# EasyEDA Pro project obd_schematic_27th_Jan_2026.eprj

# Schematic obd_schematic

## Sheets
1 gps_gsm: Board Name: Board1; Create Date: 2026-01-10; Page Name: gps_gsm; Project Name: obd_schematic_27th_Jan_2026; Schematic Name: obd_schematic; Update Date: 2026-01-30; Company: EasyEDA.com; Page Size: A4; Version: V1.0
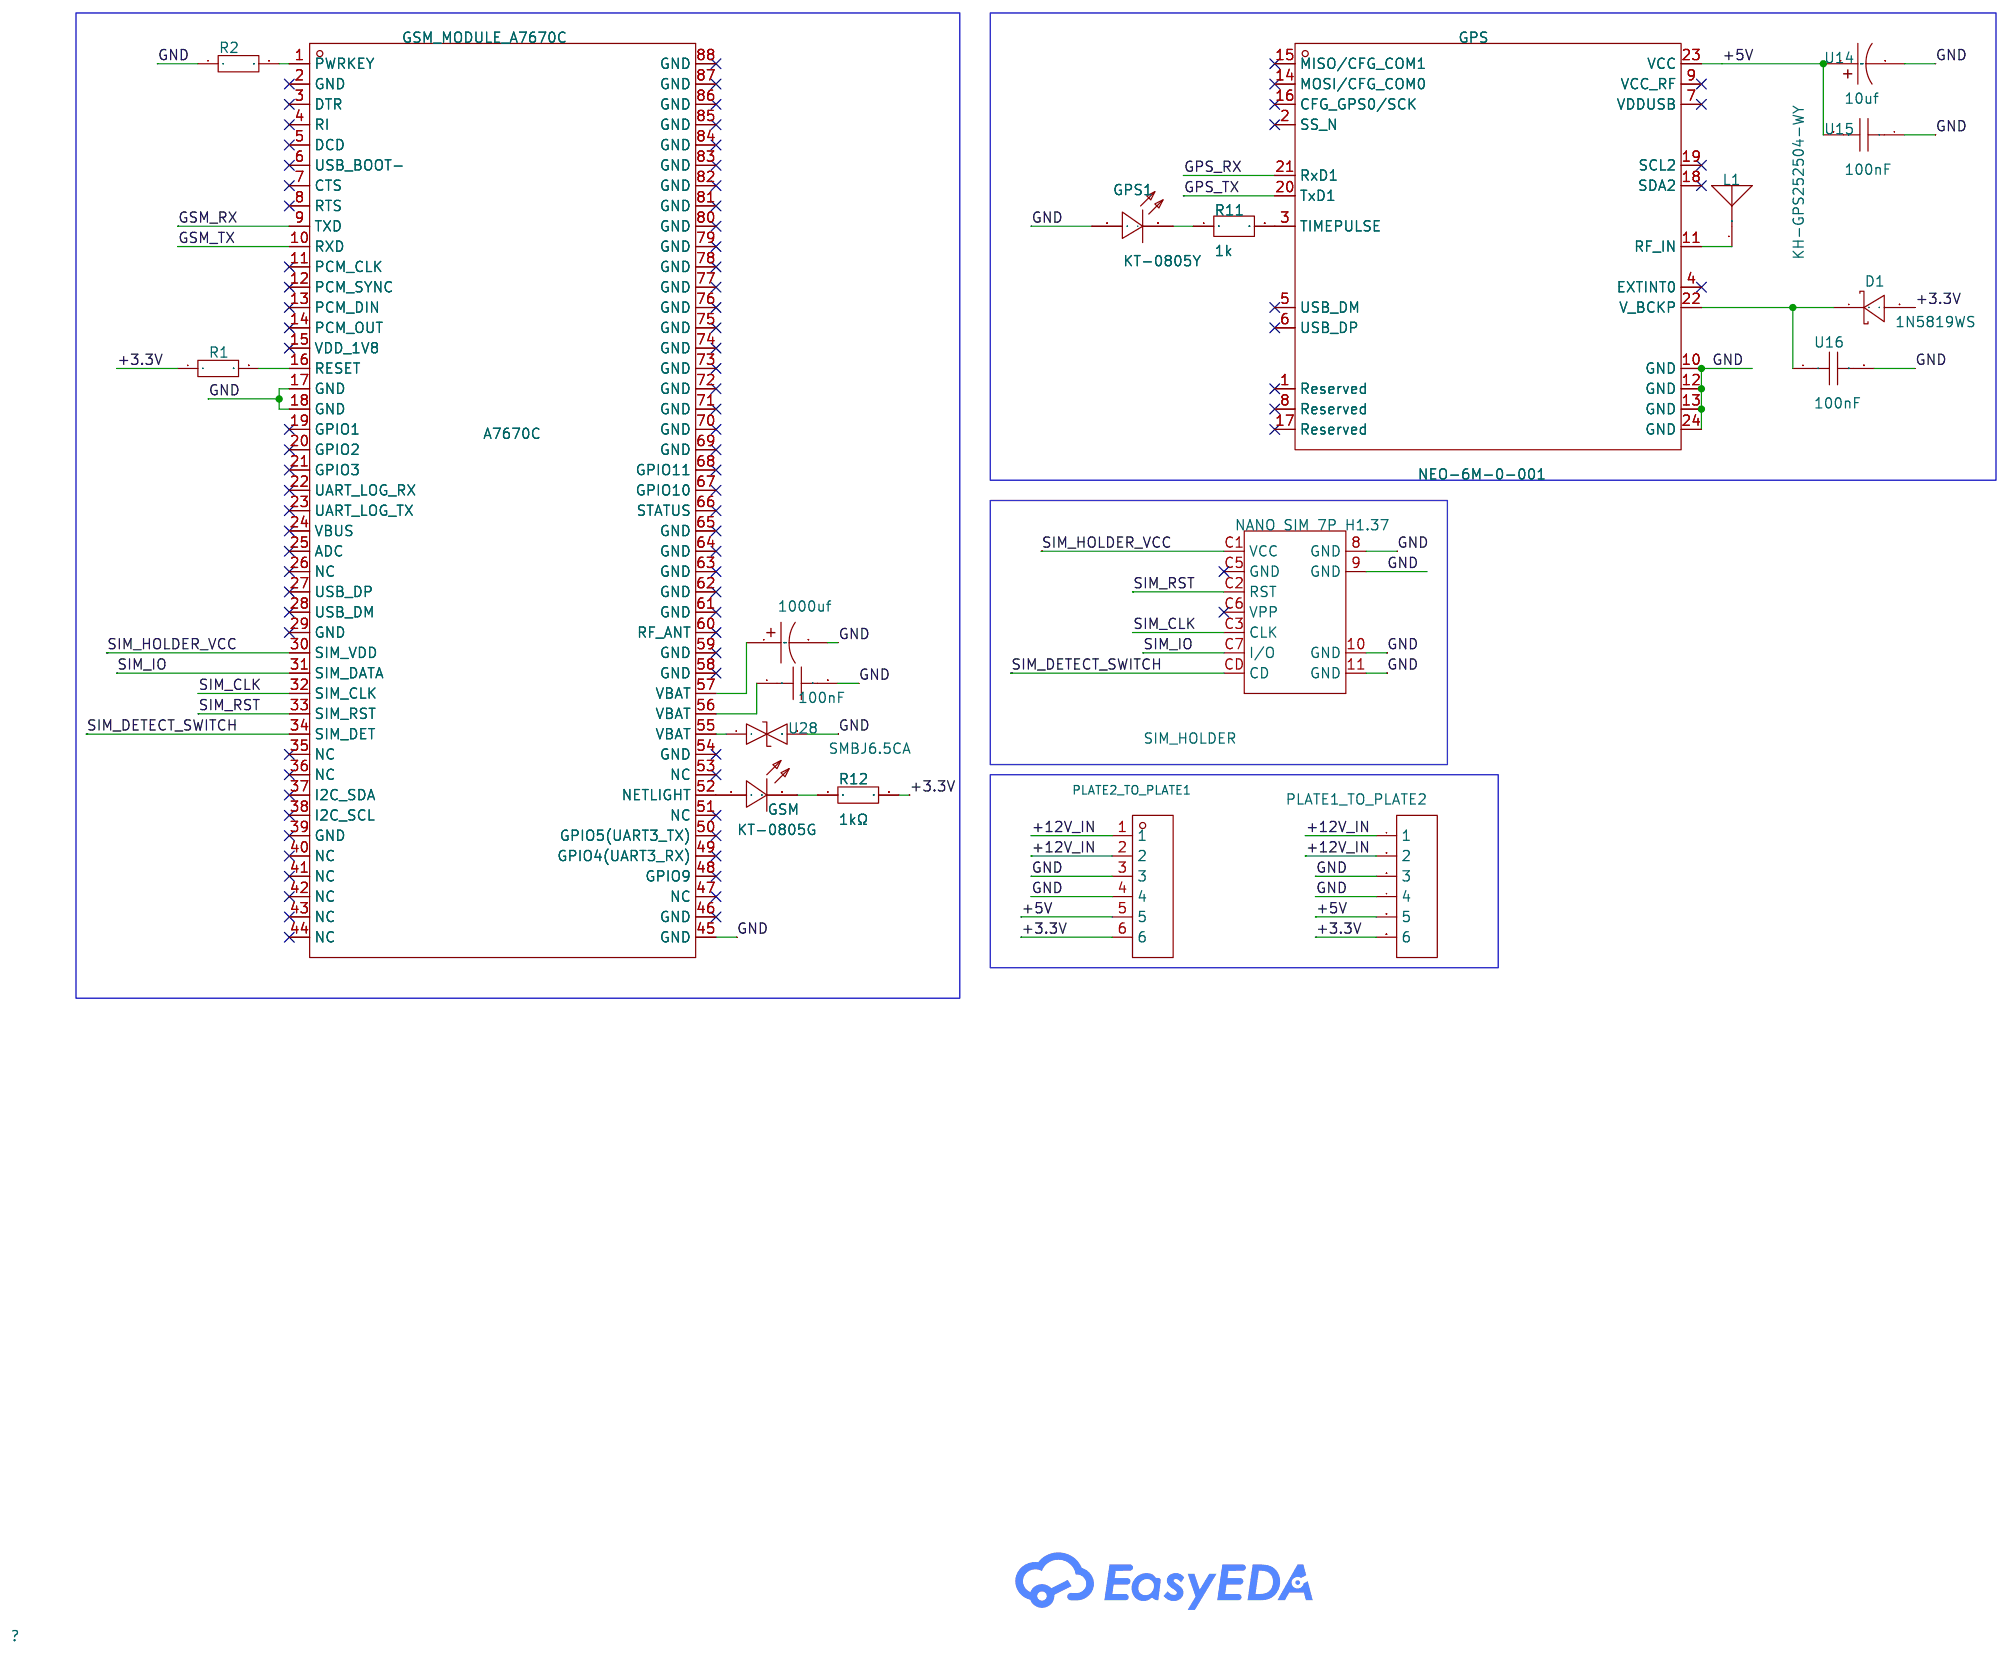
[diagram p0: gps_gsm]
2 Microcontroller: Create Date: 2026-01-23; Page Name: Microcontroller
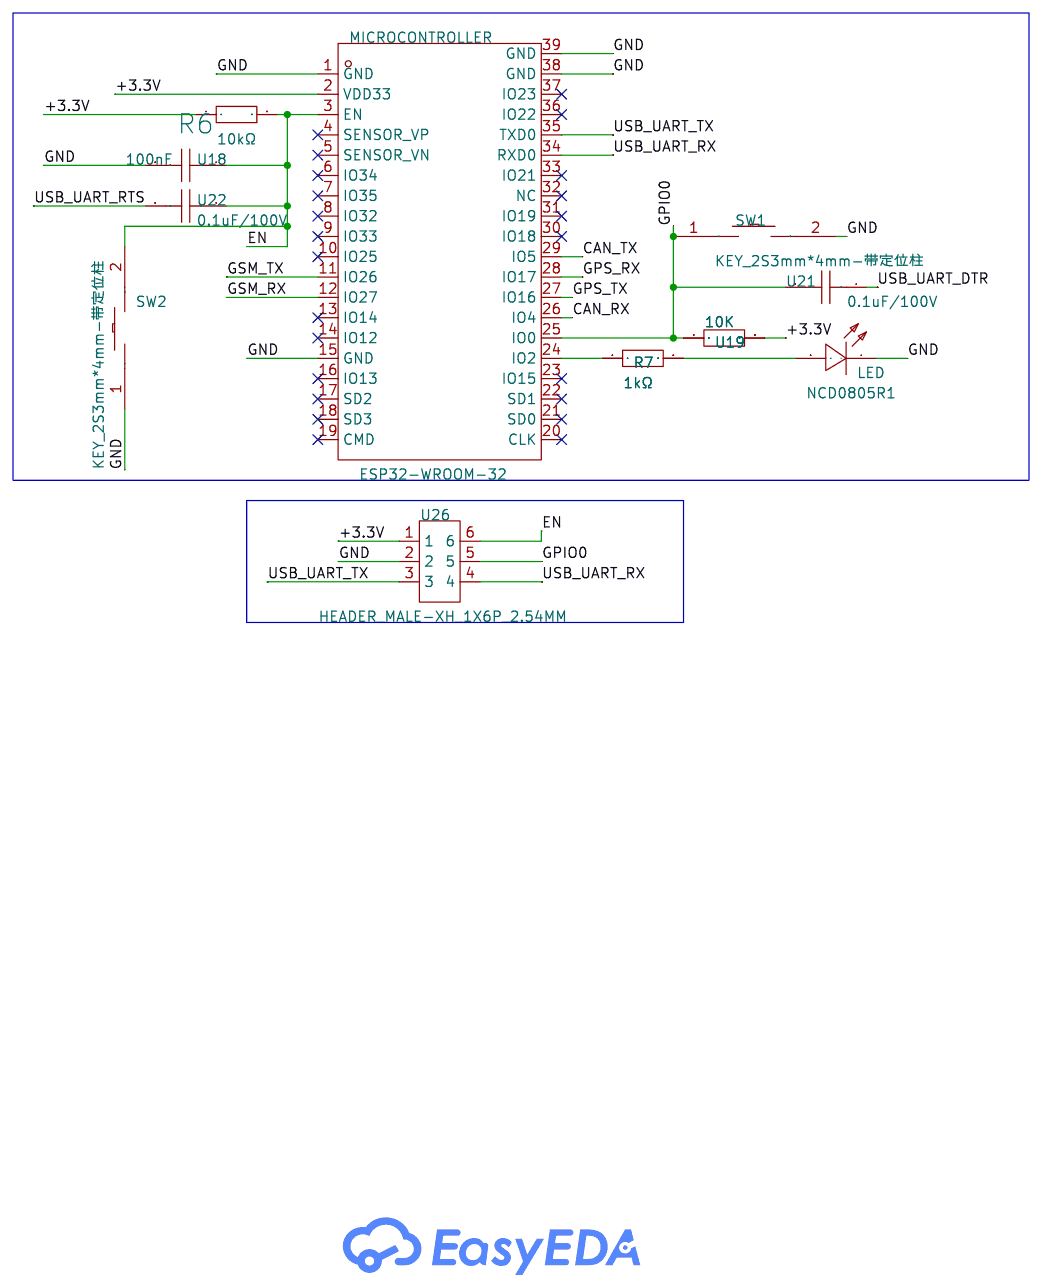
[diagram p1: Microcontroller]
3 power_supply: Create Date: 2026-01-23; Page Name: power_supply
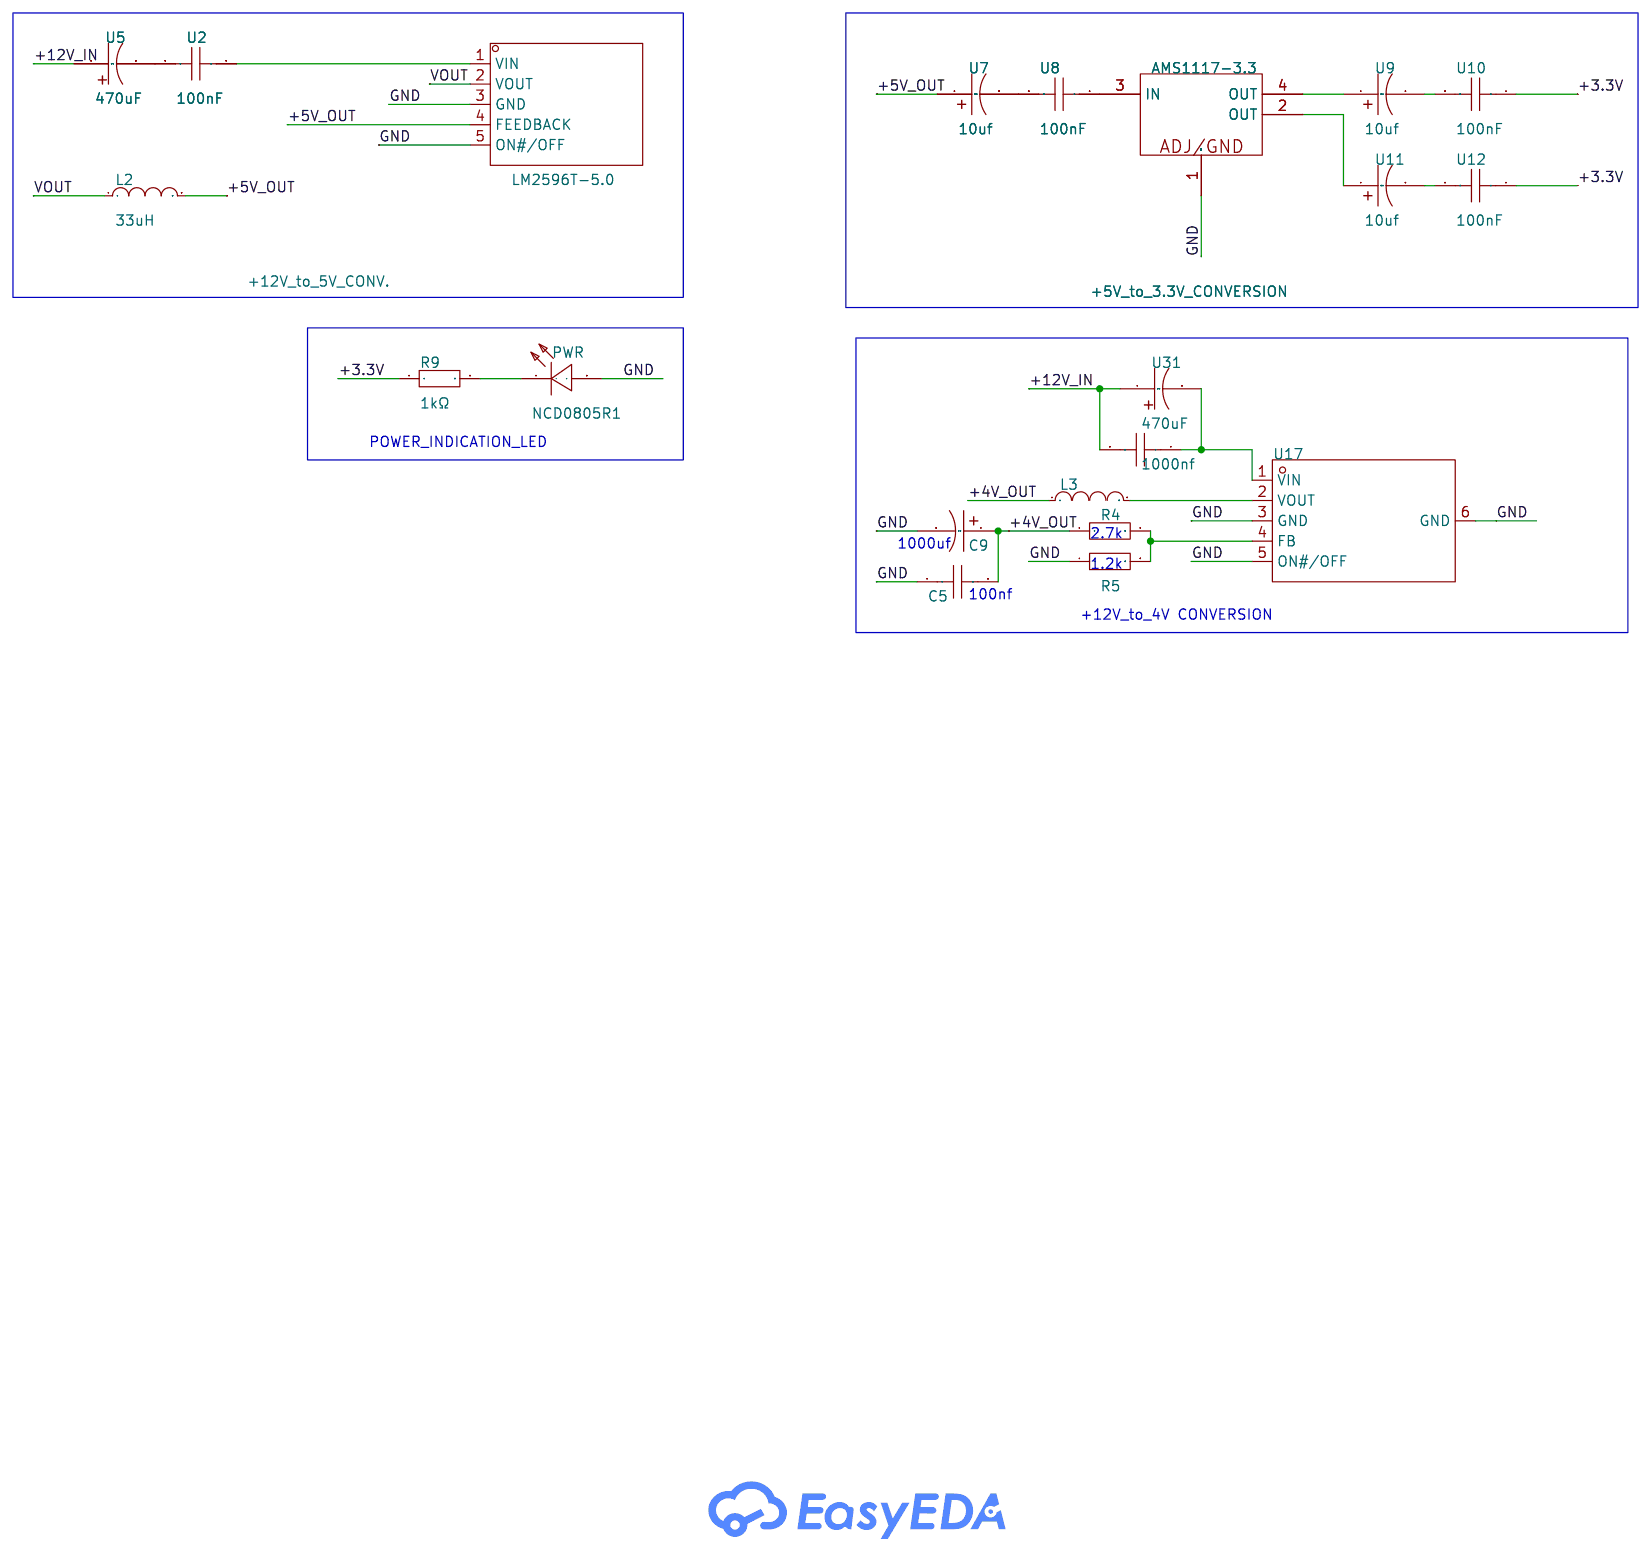
[diagram p2: power_supply]
4 usb_to_uart: Create Date: 2026-01-29; Page Name: usb_to_uart; Update Date: 2026-01-29
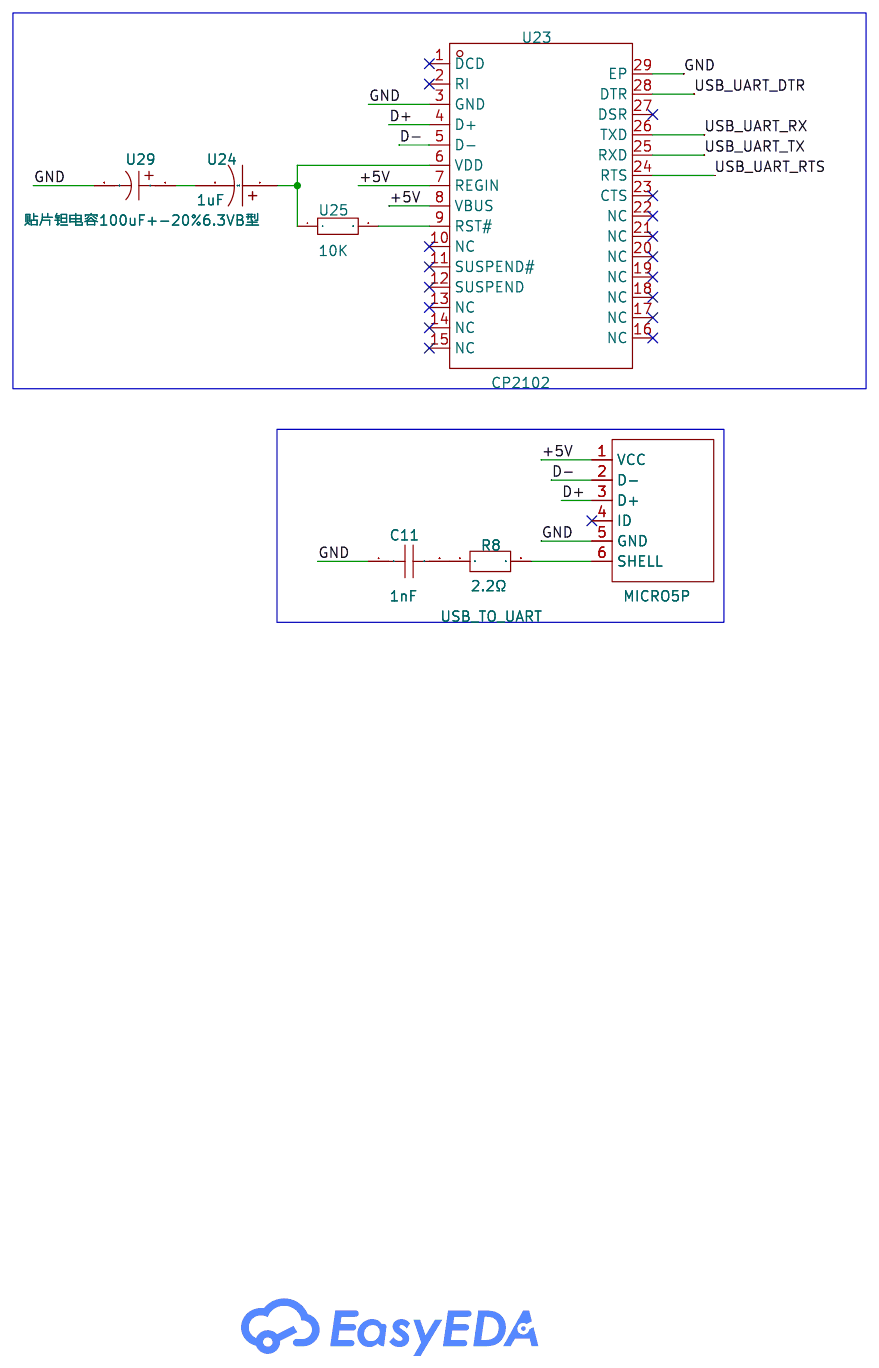
[diagram p3: usb_to_uart]
5 can_obd_male_connector: Create Date: 2026-01-30; Page Name: can_obd_male_connector
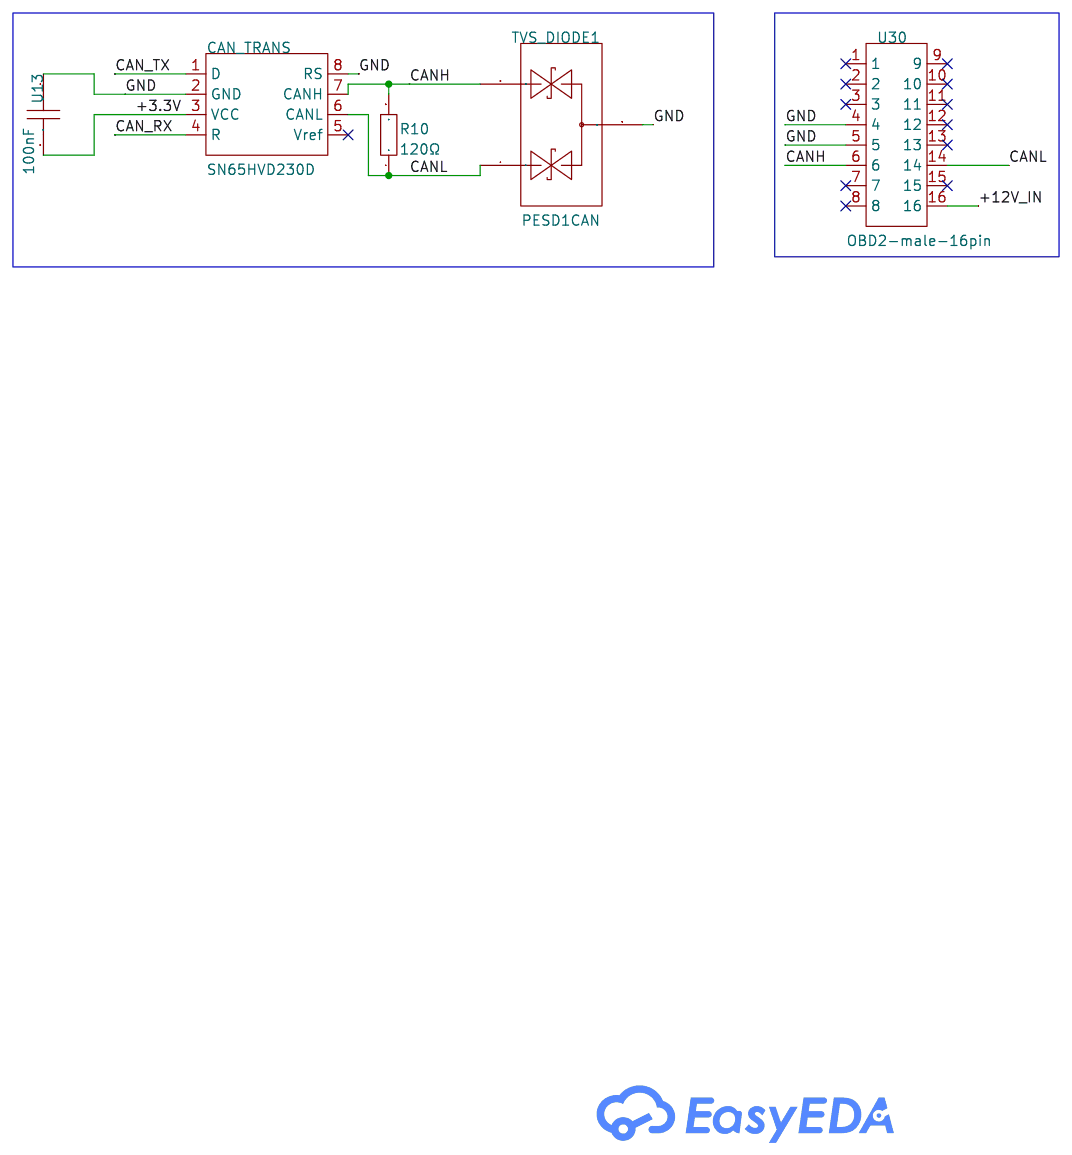
[diagram p4: can_obd_male_connector]

## Parts
sheet can_obd_male_connector
CAN_TRANS  SN65HVD230D  [SOIC-8_L4.9-W3.9-P1.27-LS6.0-BL]
R10  120Ω  [R1206]
TVS_DIODE1  PESD1CAN  [SOT-23_L2.9-W1.3-P1.90-LS2.4-BR]
U13  100nF  [CAP-TH_L5.0-W2.5-P5.00-D1.0]
U30  OBD2-male-16pin  [CONN-TH_OBD2]
sheet gps_gsm
100nF  100nF  [CAP-TH_L18.0-W6.0-P15.00-D1.2]
1000uf  1000uF  [CAP-TH_BD6.3-P2.50-D1.0-FD]
D1  1N5819WS  [SOD-323_L1.8-W1.3-LS2.5-RD]
GPS  NEO-6M-0-001  [GPSM-SMD_24P-L16.0-W12.2-P1.10]
GPS1  KT-0805Y  [LED0805-R-RD]
GSM  KT-0805G  [LED0805-R-RD]
GSM_MODULE_A7670C  A7670C  [WIRELM-SMD-88_L24.0-W24.0-P1.00-BL]
L1  KH-GPS252504-WY  [ANT-TH_KH-GPS252504-WY]
PLATE1_TO_PLATE2  -  [HDR-TH_6P-P2.54-V-M-1]
PLATE2_TO_PLATE1  -  [HDR-TH_6P-P2.54-V-F]
R1  10kΩ  [R0805]
R2  10kΩ  [R0805]
R11  1k  [R0603]
R12  1kΩ  [R0805]
SIM_HOLDER  NANO SIM 7P H1.37  [SIM-SMD_NANO-SIM-7P-H1.37]
U14  10uf  [CAP-SMD_L2.0-W1.3-FD]
U15  100nF  [CAP-TH_L5.0-W2.5-P5.00-D1.0]
U16  100nF  [CAP-TH_L5.0-W2.5-P5.00-D1.0]
U28  SMBJ6.5CA  [SMB_L4.6-W3.5-LS5.3-BI]
sheet Microcontroller
LED  NCD0805R1  [LED0805-RD]
MICROCONTROLLER  ESP32-WROOM-32  [WIFIM-SMD_39P-L25.5-W18.0-P1.27]
R6  10kΩ  [R0603]
R7  1kΩ  [R0805]
SW1  KEY_2S3mm*4mm-带定位柱  [KEY-SMD_L4.0-W3.7-LS4.8]
SW2  KEY_2S3mm*4mm-带定位柱  [KEY-SMD_L4.0-W3.7-LS4.8]
U18  100nF  [CAP-TH_L5.0-W2.5-P5.00-D1.0]
U19  10K  [R0805]
U21  0.1uF/100V  [C0805]
U22  0.1uF/100V  [C0805]
U26  HEADER_MALE-XH_1X6P_2.54MM  [CONN-TH_6P-P2.50-V-M_HEADER-MALE]
sheet power_supply
1000nf  100nF  [CAP-TH_L7.3-W3.2-P5.00-D0.5]
+5V_to_3.3V_CONVERSION  AMS1117-3.3  [SOT-223-3_L6.4-W3.5-P2.30-LS7.0-BR]
+12V_to_5V_CONV.  LM2596T-5.0  [TO-220-5L_L10.2-W4.5-P1.71-L]
C5  100nF  [CAP-TH_L18.0-W6.0-P15.00-D1.2]
C9  1000uF  [CAP-TH_BD6.3-P2.50-D1.0-FD]
L2  33uH  [IND-SMD_L7.0-W6.6_FXL0630]
L3  33uH  [IND-SMD_L6.0-W6.0]
PWR  NCD0805R1  [LED0805-RD]
R4  2.7kΩ  [R0603]
R5  1.2kΩ  [R0805]
R9  1kΩ  [R0805]
U2  100nF  [CAP-TH_L5.0-W2.5-P5.00-D1.0]
U5  470uF  [CAP-SMD_BD10.0-L10.3-W10.3-LS11.0-FD-1]
U7  10uf  [CAP-SMD_L2.0-W1.3-FD]
U8  100nF  [CAP-TH_L5.0-W2.5-P5.00-D1.0]
U9  10uf  [CAP-SMD_L2.0-W1.3-FD]
U10  100nF  [CAP-TH_L5.0-W2.5-P5.00-D1.0]
U11  10uf  [CAP-SMD_L2.0-W1.3-FD]
U12  100nF  [CAP-TH_L5.0-W2.5-P5.00-D1.0]
U17  -  [TO-263-5_L10.2-W8.6-P1.70-LS14.4-TL]
U31  470uF  [CAP-SMD_BD10.0-L10.3-W10.3-LS11.0-FD-1]
sheet usb_to_uart
C11  1nF  [C0805]
R8  2.2Ω  [RES-TH_L48.0-W10.0-P51.00-D0.8]
U23  CP2102  [QFN-28_L5.0-W5.0-P0.50-TL-EP3.2]
U24  1uF  [CAP-SMD_L3.5-W2.8-FD]
U25  10K  [R0805]
U29  贴片钽电容100uF+-20%6.3VB型  [CAP-SMD_L3.5-W2.8-FD]
USB_TO_UART  MICRO5P  [MICRO-USB-SMD_MICRO-21-P2-T3]

## Library data of the parts
CAN_TRANS = SN65HVD230D: Type:CANtransceiver Data Rate:1Mbps Supply Voltage:3V~3.6V Supply Voltage:3V~3.6V Supply Current:17mA Operating Temperature:-40℃~+85℃ Operating Temperature:-40℃~+85℃; LCSC Part Name: SN65HVD230, SN65HVD231, SN65HVD232 3.3V CAN总线收发器; Supplier Part: C1543812; Manufacturer: TI(德州仪器); Supplier Footprint: SOIC-8; JLCPCB Part Class: Extended Part; Datasheet: https://www.ti.com/cn/lit/gpn/sn65hvd230; Supplier: LCSC; Type: CANtransceiver; Data Rate: 1Mbps; Supply Voltage: 3V~3.6V; Supply Current: 17mA; Operating Temperature: -40℃~+85℃
R10 = 1206W4F1200T5E_C17909: LCSC Part Name: 120Ω ±1% 250mW 厚膜电阻; Supplier Part: C17909; Manufacturer: UNI-ROYAL(厚声); Manufacturer Part: 1206W4F1200T5E; Supplier Footprint: 1206; JLCPCB Part Class: Basic Part; Datasheet: https://item.szlcsc.com/datasheet/1206W4F1200T5E/18597.html; Supplier: LCSC; Type: Thick Film Resistor; Tolerance: ±1%; Power(Watts): 250mW; Voltage-Supply(Max): 200V; Temperature Coefficient: ±100ppm/℃; Operating Temperature: -55℃~+155℃
TVS_DIODE1 = PESD1CAN: Supplier Part: C143073; Supplier Footprint: SOT-23; JLCPCB Part Class: Extended Part; Datasheet: https://atta.szlcsc.com/upload/public/pdf/source/20171114/C143073_15106326943561117550.pdf; Supplier: LCSC; Reverse Stand-Off Voltage (Vrwm): 24V; Maximum Clamping Voltage: 52V; Peak Pulse Current (Ipp)@10/1000us: 5A@8/20us; Breakdown Voltage: 26.7V; Type: TVS
U2 U8 U10 U12 U13 U15 U16 U18 = 100nF: Supplier Part: C9900015256; JLCPCB Part Class: Extended Part; Supplier: LCSC
U30 = OBD2-male-16pin: Supplier Part: C9900147921; Supplier Footprint: 弯插,P=4mm,16P; JLCPCB Part Class: Extended Part; Supplier: LCSC
100nF C5 = SMQP104K275XXD2B1515: LCSC Part Name: 等级:X2 100nF ±10% 275VAC; Supplier Part: C263655; Manufacturer: CHAMPION(全鹏); Supplier Footprint: 径向引线,P=15mm; JLCPCB Part Class: Extended Part; Datasheet: https://atta.szlcsc.com/upload/public/pdf/source/20180829/C263655_6755E15D66B21142CC4F7302C22C0854.pdf; Supplier: LCSC; Voltage Rated(VAC): 275VAC
1000uf C9 = SHW1000UF6.3V6.3X11: LCSC Part Name: 1000uF ±20% 6.3V; Supplier Part: C494544; Manufacturer: KNSCHA(科尼盛); Supplier Footprint: 径向引线,6.3x11mm; JLCPCB Part Class: Extended Part; Datasheet: https://atta.szlcsc.com/upload/public/pdf/source/20200310/C494544_07035577F4FF2E09F690DEEEB2257D7D.pdf; Supplier: LCSC
D1 = 1N5819WS_C191023: LCSC Part Name: 电压:40V 电流:1A; Supplier Part: C191023; Manufacturer: Hottech(合科泰); Supplier Footprint: SOD-323; JLCPCB Part Class: Basic Part; Datasheet: https://item.szlcsc.com/datasheet/1N5819WS/213850.html; Supplier: LCSC; Voltage - Forward(Vf@If): 600mV@1A; Voltage - DC Reverse(Vr): 40V; Current - Rectified: 1A; Non-Repetitive Peak Forward Surge Current: 25A
GPS = NEO-6M-0-001: Supplier Part: C9900141426; Supplier Footprint: SMD; Supplier: LCSC
GPS1 = KT-0805Y: LCSC Part Name: 0805 黄灯 高亮; Supplier Part: C2296; Manufacturer: KENTO; Supplier Footprint: 0805; JLCPCB Part Class: Basic Part; Datasheet: https://item.szlcsc.com/datasheet/KT-0805Y/2669.html; Supplier: LCSC; Illumination Color: Yellow; Voltage - Forward(Vf): 1.8V~2.4V; Power(Watts): 40mW; Wavelength - Dominant: 584nm~594nm; Peak Wavelength: 596nm; Lens Color: Water Clear; Luminous Intensity: 175mcd; Viewing Angle: 120°; Operating Temperature: -40℃~+85℃
GSM = KT-0805G: LCSC Part Name: 0805 翠绿 高亮; Supplier Part: C2297; Manufacturer: KENTO; Supplier Footprint: 0805; JLCPCB Part Class: Basic Part; Datasheet: https://item.szlcsc.com/datasheet/KT-0805G/2670.html; Supplier: LCSC; Illumination Color: Emerald Green; Voltage - Forward(Vf): 2.6V~3.1V; Power(Watts): 100mW; Forward Current: 5mA; Wavelength - Dominant: 513nm~528nm; Peak Wavelength: 525nm; Luminous Intensity: 430mcd; Viewing Angle: 120°; Operating Temperature: -40℃~+85℃
GSM_MODULE_A7670C = A7670C: Supplier Part: C2840705; Supplier Footprint: SMD,24x24mm; Datasheet: https://atta.szlcsc.com/upload/public/pdf/source/20211010/C2840705_2132252035537002BCA59B77BA5721D5.pdf; Supplier: LCSC
L1 = KH-GPS252504-WY: Frequency(Center/Band):1.57542GHz Bandwidth:10MHz Peak Gain:3.5dBi Peak Gain:3.5dBi Impedance:50Ω VSWR:1.5 Operating Temperature:-45℃~+75℃ Operating Temperature:-45℃~+75℃; LCSC Part Name: GPS无源陶瓷天线，尺寸25*25*4mm，频率1575.42MHZ; Supplier Part: C962216; Manufacturer: kinghelm(金航标); JLCPCB Part Class: Extended Part; Datasheet: https://item.szlcsc.com/datasheet/KH-GPS252504-WY/1043574.html; Supplier: LCSC; Frequency(Center/Band): 1.57542GHz; Bandwidth: 10MHz; Peak Gain: 3.5dBi; Impedance: 50Ω; VSWR: 1.5; Operating Temperature: -45℃~+75℃
PLATE1_TO_PLATE2 = HDR-M_2.54_1x6P: Supplier Footprint: Through
PLATE2_TO_PLATE1 = HDR-F_2.54_1x6P: Supplier Footprint: Through
R1 R2 = RMCF0805FT10K0: LCSC Part Name: 10kΩ ±1%; Supplier Part: C237755; Manufacturer: SEI(Stackpole Electronics Inc.); Supplier Footprint: 0805; JLCPCB Part Class: Extended Part; Datasheet: https://atta.szlcsc.com/upload/public/pdf/source/20181205/C237755_30FA738726C69E37C86821B0BDD56A4F.pdf; Supplier: LCSC
R11 = 1k: Supplier Part: C9900012840; JLCPCB Part Class: Extended Part; Supplier: LCSC
R7 R9 R12 = 0805W8F1001T5E: LCSC Part Name: 1kΩ ±1% 125mW 厚膜电阻; Supplier Part: C17513; Manufacturer: UNI-ROYAL(厚声); Supplier Footprint: 0805; Datasheet: https://atta.szlcsc.com/upload/public/pdf/source/20200306/C422600_1E6D84923E4A46A82E41ADD87F860B5C.pdf; Supplier: LCSC; Type: Thick Film Resistors; Tolerance: ±1%; Temperature Coefficient: ±100ppm/℃; Operating Temperature Range: -55℃~+155℃
SIM_HOLDER = NANO SIM 7P H1.37: Card Connection Mode:Push-Push Card Type:Nano-SIM Card Connector Type:Connector and Ejector Card Detection:With Card Detect Supplementary Features:- Height Above Board:1.37mm Operating Temperature:-40℃~+70℃ Operating Temperature:-40℃~+70℃; LCSC Part Name: 自弹式 NanoSIM卡 卡座; Supplier Part: C7529384; Manufacturer: SHOU HAN(首韩); Supplier Footprint: SMD; JLCPCB Part Class: Extended Part; Datasheet: https://item.szlcsc.com/datasheet/NANO%2520SIM%25207P%2520H1.37/8629771.html; Supplier: LCSC; Card Connection Mode: Push-Push; Card Type: Nano-SIM Card; Connector Type: Connector and Ejector; Card Detection: With Card Detect; Height Above Board: 1.37mm; Operating Temperature: -40℃~+70℃
U7 U9 U11 U14 = 10uf: Supplier Part: C9900016685; Supplier Footprint: SMD,2x1.25x1.2mm; Supplier: LCSC
U28 = SMBJ6.5CA_C7420377: LCSC Part Name: 双向TVS 6.5V截止 峰值浪涌电流：53.57A; Supplier Part: C7420377; Manufacturer: R+O(宏嘉诚); Supplier Footprint: DO-214AA(SMB); JLCPCB Part Class: Basic Part; Datasheet: https://item.szlcsc.com/datasheet/SMBJ6.5CA/8397199.html; Supplier: LCSC; Polarity: Bidirectional; Reverse Stand-Off Voltage (Vrwm): 6.5V; Clamping Voltage: 11.2V; Peak Pulse Current (Ipp): 53.57A; Peak Pulse Power Dissipation (Ppp): 600W; Voltage - Breakdown: 7.22V; Reverse Leakage Current (Ir): 500uA; Number of Channels: 1; Operating Temperature: -55℃~+150℃; level of protection: IEC 61000-4-2; Type: TVS
LED PWR = NCD0805R1_C84256: Supplier Part: C84256; Manufacturer: 国星光电; Supplier Footprint: 0805; JLCPCB Part Class: Basic Part; Datasheet: https://atta.szlcsc.com/upload/public/pdf/source/20200820/C84256_F0A75A43B3EAD75808600A0514C76B99.pdf; Supplier: LCSC; Emitted Color: Red; Forward Voltage (VF): 1.6V~2.6V; Power Dissipation: 65mW; Forward Current: 20mA; Dominant Wavelength: 615nm~630nm; Diode Configuration: 独立二极管; Lens Color: 无色透明透镜; Luminous Intensity: 67mcd~195mcd; Viewing Angle: 130°; Operating Temperature: -30℃~+85℃
MICROCONTROLLER = ESP32-WROOM-32: LCSC Part Name: WIFI&BT模块; Supplier Part: C503587; Supplier: LCSC
R6 = 0603WAF1002T5E: LCSC Part Name: 厚膜电阻 10kΩ ±1% 100mW; Supplier Part: C25804; Manufacturer: UNI-ROYAL(厚声); Supplier Footprint: 0603; JLCPCB Part Class: Basic Part; Datasheet: https://item.szlcsc.com/datasheet/0603WAF1002T5E/26547.html; Supplier: LCSC; Type: Thick Film Resistor; Tolerance: ±1%; Power(Watts): 100mW; Voltage-Supply(Max): 75V; Temperature Coefficient: ±100ppm/℃; Operating Temperature: -55℃~+155℃
SW1 SW2 = KEY_2S3mm*4mm-带定位柱: Supplier Part: C9900019844; Supplier Footprint: 二脚小乌龟SW_PUSH-带定位柱; JLCPCB Part Class: Extended Part; Supplier: LCSC
U19 U25 = 10K: Supplier Part: C9900011271; JLCPCB Part Class: Extended Part; Supplier: LCSC
U21 U22 = 0.1uF/100V_C9900010259: Supplier Part: C9900010259; JLCPCB Part Class: Extended Part; Supplier: LCSC
U26 = HEADER_MALE-XH_1X6P_2.54MM: Supplier Part: C9900007627; JLCPCB Part Class: Extended Part; Supplier: LCSC
1000nf = MMTSA0050J10400000200: LCSC Part Name: 100nF ±5% 50V; Supplier Part: C359275; Manufacturer: NISSEI(日精); Supplier Footprint: 径向引线,P=5mm; JLCPCB Part Class: Extended Part; Datasheet: https://atta.szlcsc.com/upload/public/pdf/source/20190320/C359275_AEF71E5AE67C43B3EDC8CAF33BCDD671.pdf; Supplier: LCSC; Tolerance: ±5%; Dielectric Material: Metallized Polyester; Operating Temperature: -40℃~+105℃
+5V_to_3.3V_CONVERSION = AMS1117-3.3: LCSC Part Name: 1A低压差线性稳压器; Supplier Part: C2992570; Manufacturer: 国芯佳品; Supplier Footprint: SOT-223-3; JLCPCB Part Class: Extended Part; Datasheet: https://item.szlcsc.com/datasheet/AMS1117-3.3/3457622.html; Supplier: LCSC; Output Type: Fixed; Voltage - Supply: 15V; Output Voltage: 3.3V; Output Current: 1A; Voltage Dropout: 1.3V@(1A); standby current: 4mA; Features: Over Current Protection；Over Temperature Protection; Operating Temperature: -40℃~+125℃@(Ta); Output Configuration: Positive; Number of Outputs: 1
+12V_to_5V_CONV. = LM2596T-5.0: Supplier Part: C192249; Supplier Footprint: TO-220-5; JLCPCB Part Class: Extended Part; Supplier: LCSC; Function: Step-down type; Input Voltage: 8V~40V; Output Current (Max): 3A; Switching Frequency: 150kHz; Synchronous Rectification: NO; Number of Outputs: 1; Topology: Step-down
L2 = 33uH: Supplier Part: C9900023951; Supplier Footprint: L0630; JLCPCB Part Class: Extended Part; Supplier: LCSC
L3 = CKCS6045-33uH/M: LCSC Part Name: 33uH ±20% 1.45A 137mΩ; Supplier Part: C354635; Manufacturer: CENKER(岑科); Supplier Footprint: SMD; JLCPCB Part Class: Extended Part; Datasheet: https://atta.szlcsc.com/upload/public/pdf/source/20190115/C354635_35C263AE2940383043B06318637635F6.pdf; Supplier: LCSC
R4 = RC0603JR-072K7L: LCSC Part Name: 2.7kΩ ±5%; Supplier Part: C127451; Manufacturer: YAGEO(国巨); Supplier Footprint: 0603; JLCPCB Part Class: Extended Part; Datasheet: https://atta.szlcsc.com/upload/public/pdf/source/20170914/C127451_1505359407456967678.pdf; Supplier: LCSC
R5 = RC0805FR-071K2L: LCSC Part Name: 1.2kΩ ±1%; Supplier Part: C114526; Manufacturer: YAGEO(国巨); Supplier Footprint: 0805; JLCPCB Part Class: Extended Part; Datasheet: https://atta.szlcsc.com/upload/public/pdf/source/20170912/C114526_1505207767877963405.pdf; Supplier: LCSC; Type: Thick Film Resistors
U5 U31 = 470uF: Supplier Part: C9900012754; Supplier Footprint: SMD(10*10.2); JLCPCB Part Class: Extended Part; Supplier: LCSC
U17 = LM2596S-ADJ/TR: Supplier Part: C508707; Manufacturer: HGC(华冠); Supplier Footprint: TO-263-5; JLCPCB Part Class: Extended Part; Datasheet: https://atta.szlcsc.com/upload/public/pdf/source/20210419/C340930_48163ADD0F81828319BE481FCEEE6929.pdf; Supplier: LCSC
C11 = C2012X7R2A102M/10: LCSC Part Name: 1nF ±20% 100V; Supplier Part: C19606016; Manufacturer: TDK; Datasheet: https://atta.szlcsc.com/upload/public/pdf/source/20231219/C68DABE78D3F035B2C6D865BDB47C6DA.pdf; Supplier: LCSC; Tolerance: ±20%; Voltage Rating: 100V; Temperature Coefficient: X7R
R8 = CERAMIC RESISTOR 10W/ 2,2 OHM: LCSC Part Name: 陶瓷电阻 2.2Ω 10W; Supplier Part: C7107345; Manufacturer: Visaton; Supplier Footprint: 插件; JLCPCB Part Class: Extended Part; Supplier: LCSC; Type: Ceramic resistor; Power(Watts): 10W
U23 = CP2102: Supplier Part: C9900004371; Supplier Footprint: QFN-28-EP(5x5); Supplier: LCSC
U24 = CA45-B-35V-1uF-K: LCSC Part Name: 1uF ±10% 35V; Supplier Part: C503896; Manufacturer: TORCH(火炬); Supplier Footprint: CASE-B-3528-19(mm); Datasheet: https://item.szlcsc.com/datasheet/CA45-B-35V-1uF-K/516605.html; Supplier: LCSC; Tolerance: ±10%; Voltage Rating: 35V; Equivalent Series Resistance(ESR): 3.5Ω@100kHz; Operating Temperature: -55℃~+125℃
U29 = 贴片钽电容100uF+-20%6.3VB型: Supplier Part: C9900014621; Supplier: LCSC
USB_TO_UART = MICRO5P: Supplier Part: C9900018929; JLCPCB Part Class: Extended Part; Supplier: LCSC

## Nets
+3.3V: CAN_TRANS.3(VCC) D1.2(A) MICROCONTROLLER.2(VDD33) PLATE1_TO_PLATE2.6 PLATE2_TO_PLATE1.6 R1.1 R6.1 R9.1 R12.2 U10.1 U12.1 U13.2 U19.2 U26.1
+4V_OUT: C5.2 C9.1 L3.1 R4.1
+5V: GPS.23(VCC) PLATE1_TO_PLATE2.5 PLATE2_TO_PLATE1.5 U14.1 U15.2 U23.7(REGIN) U23.8(VBUS) USB_TO_UART.1(VCC)
+5V_OUT: +12V_to_5V_CONV..4(FEEDBACK) L2.2 U7.1
+12V_IN: 1000nf.2 PLATE1_TO_PLATE2.1 PLATE1_TO_PLATE2.2 PLATE2_TO_PLATE1.1 PLATE2_TO_PLATE1.2 U5.1 U30.16 U31.1
GND: 100nF.2 1000uf.2 +5V_to_3.3V_CONVERSION.1(ADJ/GND) +12V_to_5V_CONV..3(GND) +12V_to_5V_CONV..5(ON#/OFF) C5.1 C9.2 C11.1 CAN_TRANS.2(GND) CAN_TRANS.8(RS) GPS.10(GND) GPS.12(GND) GPS.13(GND) GPS.24(GND) GPS1.1(+) GSM_MODULE_A7670C.17(GND) GSM_MODULE_A7670C.18(GND) GSM_MODULE_A7670C.45(GND) LED.1(-) MICROCONTROLLER.1(GND) MICROCONTROLLER.15(GND) MICROCONTROLLER.38(GND) MICROCONTROLLER.39(GND) PLATE1_TO_PLATE2.3 PLATE1_TO_PLATE2.4 PLATE2_TO_PLATE1.3 PLATE2_TO_PLATE1.4 PWR.2(+) R2.1 R5.1 SIM_HOLDER.8(GND) SIM_HOLDER.9(GND) SIM_HOLDER.10(GND) SIM_HOLDER.11(GND) SW1.2 SW2.1 TVS_DIODE1.3 U13.1 U14.2 U15.1 U16.2 U17.3(GND) U17.5(ON#/OFF) U17.6(GND) U18.2 U23.3(GND) U23.29(EP) U26.2 U28.2 U29.2 U30.4 U30.5 USB_TO_UART.5(GND)
CAN_RX: CAN_TRANS.4(R) MICROCONTROLLER.26(IO4)
CAN_TX: CAN_TRANS.1(D) MICROCONTROLLER.29(IO5)
CANH: CAN_TRANS.7(CANH) R10.2 TVS_DIODE1.2 U30.6
CANL: CAN_TRANS.6(CANL) R10.1 TVS_DIODE1.1 U30.14
D+: U23.4(D+) USB_TO_UART.3(D+)
D-: U23.5(D-) USB_TO_UART.2(D-)
EN: MICROCONTROLLER.3(EN) R6.2 SW2.2 U18.1 U22.1 U26.6
GPIO0: MICROCONTROLLER.25(IO0) SW1.1 U19.1 U21.2 U26.5
GPS_RX: GPS.21(RxD1) MICROCONTROLLER.28(IO17)
GPS_TX: GPS.20(TxD1) MICROCONTROLLER.27(IO16)
GSM_RX: GSM_MODULE_A7670C.9(TXD) MICROCONTROLLER.12(IO27)
GSM_TX: GSM_MODULE_A7670C.10(RXD) MICROCONTROLLER.11(IO26)
SIM_CLK: GSM_MODULE_A7670C.32(SIM_CLK) SIM_HOLDER.C3(CLK)
SIM_DETECT_SWITCH: GSM_MODULE_A7670C.34(SIM_DET) SIM_HOLDER.CD
SIM_HOLDER_VCC: GSM_MODULE_A7670C.30(SIM_VDD) SIM_HOLDER.C1(VCC)
SIM_IO: GSM_MODULE_A7670C.31(SIM_DATA) SIM_HOLDER.C7(I/O)
SIM_RST: GSM_MODULE_A7670C.33(SIM_RST) SIM_HOLDER.C2(RST)
USB_UART_DTR: U21.1 U23.28(DTR)
USB_UART_RTS: U22.2 U23.24(RTS)
USB_UART_RX: MICROCONTROLLER.34(RXD0) U23.26(TXD) U26.4
USB_UART_TX: MICROCONTROLLER.35(TXD0) U23.25(RXD) U26.3
VOUT: +12V_to_5V_CONV..2(VOUT) L2.1
$1N1078: 1000uf.1 GSM_MODULE_A7670C.57(VBAT)
$1N1116: GPS.11(RF_IN) L1.1(ANT)
$1N3188: D1.1(K) GPS.22(V_BCKP) U16.1
$1N3638: 100nF.1 GSM_MODULE_A7670C.56(VBAT)
$1N3712: GSM_MODULE_A7670C.16(RESET) R1.2
$1N3809: GSM_MODULE_A7670C.1(PWRKEY) R2.2
$1N4748: GSM_MODULE_A7670C.55(VBAT) U28.1
$1N5005: GPS.3(TIMEPULSE) R11.2
$1N5227: GPS1.2(-) R11.1
$1N5278: GSM.1(A) GSM_MODULE_A7670C.52(NETLIGHT)
$1N5354: GSM.2(K) R12.1
$2N648: MICROCONTROLLER.24(IO2) R7.1
$2N717: LED.2(+) R7.2
$3N837: +12V_to_5V_CONV..1(VIN) U2.1
$3N857: U2.2 U5.2
$3N1197: U7.2 U8.2
$3N1229: +5V_to_3.3V_CONVERSION.3(IN) U8.1
$3N1326: U9.2 U10.2
$3N1394: U11.2 U12.2
$3N1420: +5V_to_3.3V_CONVERSION.4(OUT) U9.1
$3N1424: +5V_to_3.3V_CONVERSION.2(OUT) U11.1
$3N2161: L3.2 U17.2(VOUT)
$3N2341: R4.2 R5.2 U17.4(FB)
$3N4197: PWR.1(-) R9.2
$3N4815: 1000nf.1 U17.1(VIN) U31.2
$4N246: U23.6(VDD) U24.1 U25.1
$4N249: U24.2 U29.1
$4N565: R8.2 USB_TO_UART.6(SHELL)
$4N621: C11.2 R8.1
$4N647: U23.9(RST#) U25.2

Not connected (* = marked no-connect by the designer): CAN_TRANS 5(Vref)*; GPS 1(Reserved)* 2(SS_N)* 4(EXTINT0)* 5(USB_DM)* 6(USB_DP)* 7(VDDUSB)* 8(Reserved)* 9(VCC_RF)* 14(MOSI/CFG_COM0)* 15(MISO/CFG_COM1)* 16(CFG_GPS0/SCK)* 17(Reserved)* 18(SDA2)* 19(SCL2)*; GSM_MODULE_A7670C 2(GND)* 3(DTR)* 4(RI)* 5(DCD)* 6(USB_BOOT-)* 7(CTS)* 8(RTS)* 11(PCM_CLK)* 12(PCM_SYNC)* 13(PCM_DIN)* 14(PCM_OUT)* 15(VDD_1V8)* 19(GPIO1)* 20(GPIO2)* 21(GPIO3)* 22(UART_LOG_RX)* 23(UART_LOG_TX)* 24(VBUS)* 25(ADC)* 26(NC)* 27(USB_DP)* 28(USB_DM)* 29(GND)* 35(NC)* 36(NC)* 37(I2C_SDA)* 38(I2C_SCL)* 39(GND)* 40(NC)* 41(NC)* 42(NC)* 43(NC)* 44(NC)* 46(GND)* 47(NC)* 48(GPIO9)* 49(GPIO4(UART3_RX))* 50(GPIO5(UART3_TX))* 51(NC)* 53(NC)* 54(GND)* 58(GND)* 59(GND)* 60(RF_ANT)* 61(GND)* 62(GND)* 63(GND)* 64(GND)* 65(GND)* 66(STATUS)* 67(GPIO10)* 68(GPIO11)* 69(GND)* 70(GND)* 71(GND)* 72(GND)* 73(GND)* 74(GND)* 75(GND)* 76(GND)* 77(GND)* 78(GND)* 79(GND)* 80(GND)* 81(GND)* 82(GND)* 83(GND)* 84(GND)* 85(GND)* 86(GND)* 87(GND)* 88(GND)*; MICROCONTROLLER 4(SENSOR_VP)* 5(SENSOR_VN)* 6(IO34)* 7(IO35)* 8(IO32)* 9(IO33)* 10(IO25)* 13(IO14)* 14(IO12)* 16(IO13)* 17(SD2)* 18(SD3)* 19(CMD)* 20(CLK)* 21(SD0)* 22(SD1)* 23(IO15)* 30(IO18)* 31(IO19)* 32(NC)* 33(IO21)* 36(IO22)* 37(IO23)*; SIM_HOLDER C5(GND)* C6(VPP)*; U23 1(DCD)* 2(RI)* 10(NC)* 11(SUSPEND#)* 12(SUSPEND)* 13(NC)* 14(NC)* 15(NC)* 16(NC)* 17(NC)* 18(NC)* 19(NC)* 20(NC)* 21(NC)* 22(NC)* 23(CTS)* 27(DSR)*; U30 1* 2* 3* 7* 8* 9* 10* 11* 12* 13* 15*; USB_TO_UART 4(ID)*

## Notes on the sheets
sheet 3
- POWER_INDICATION_LED
- 1000uf
- 2.7k
- 1.2k
- 100nf
- +12V_to_4V CONVERSION

# Board PCB4
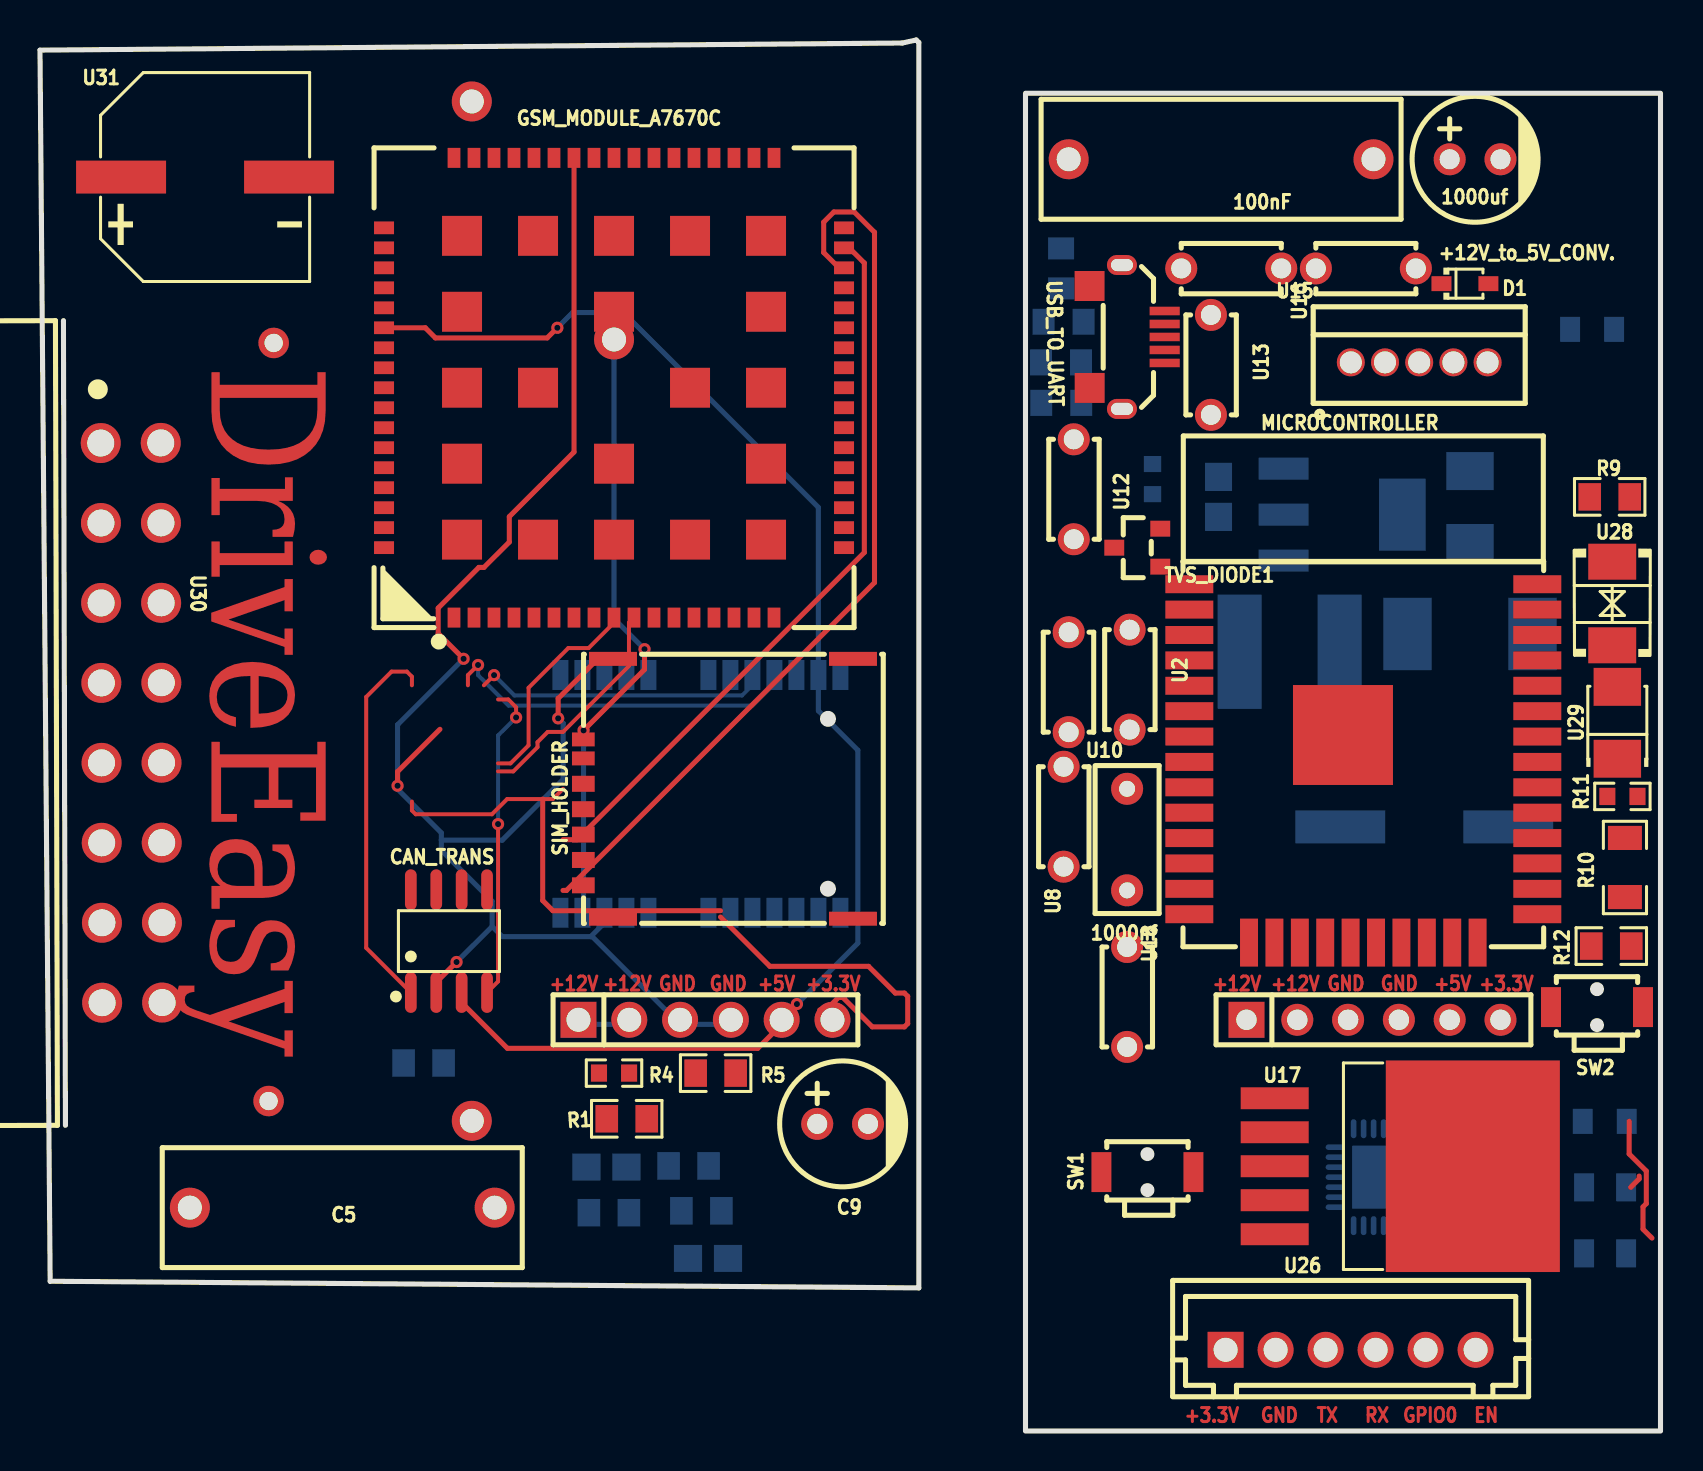
[diagram p5: board, top side]
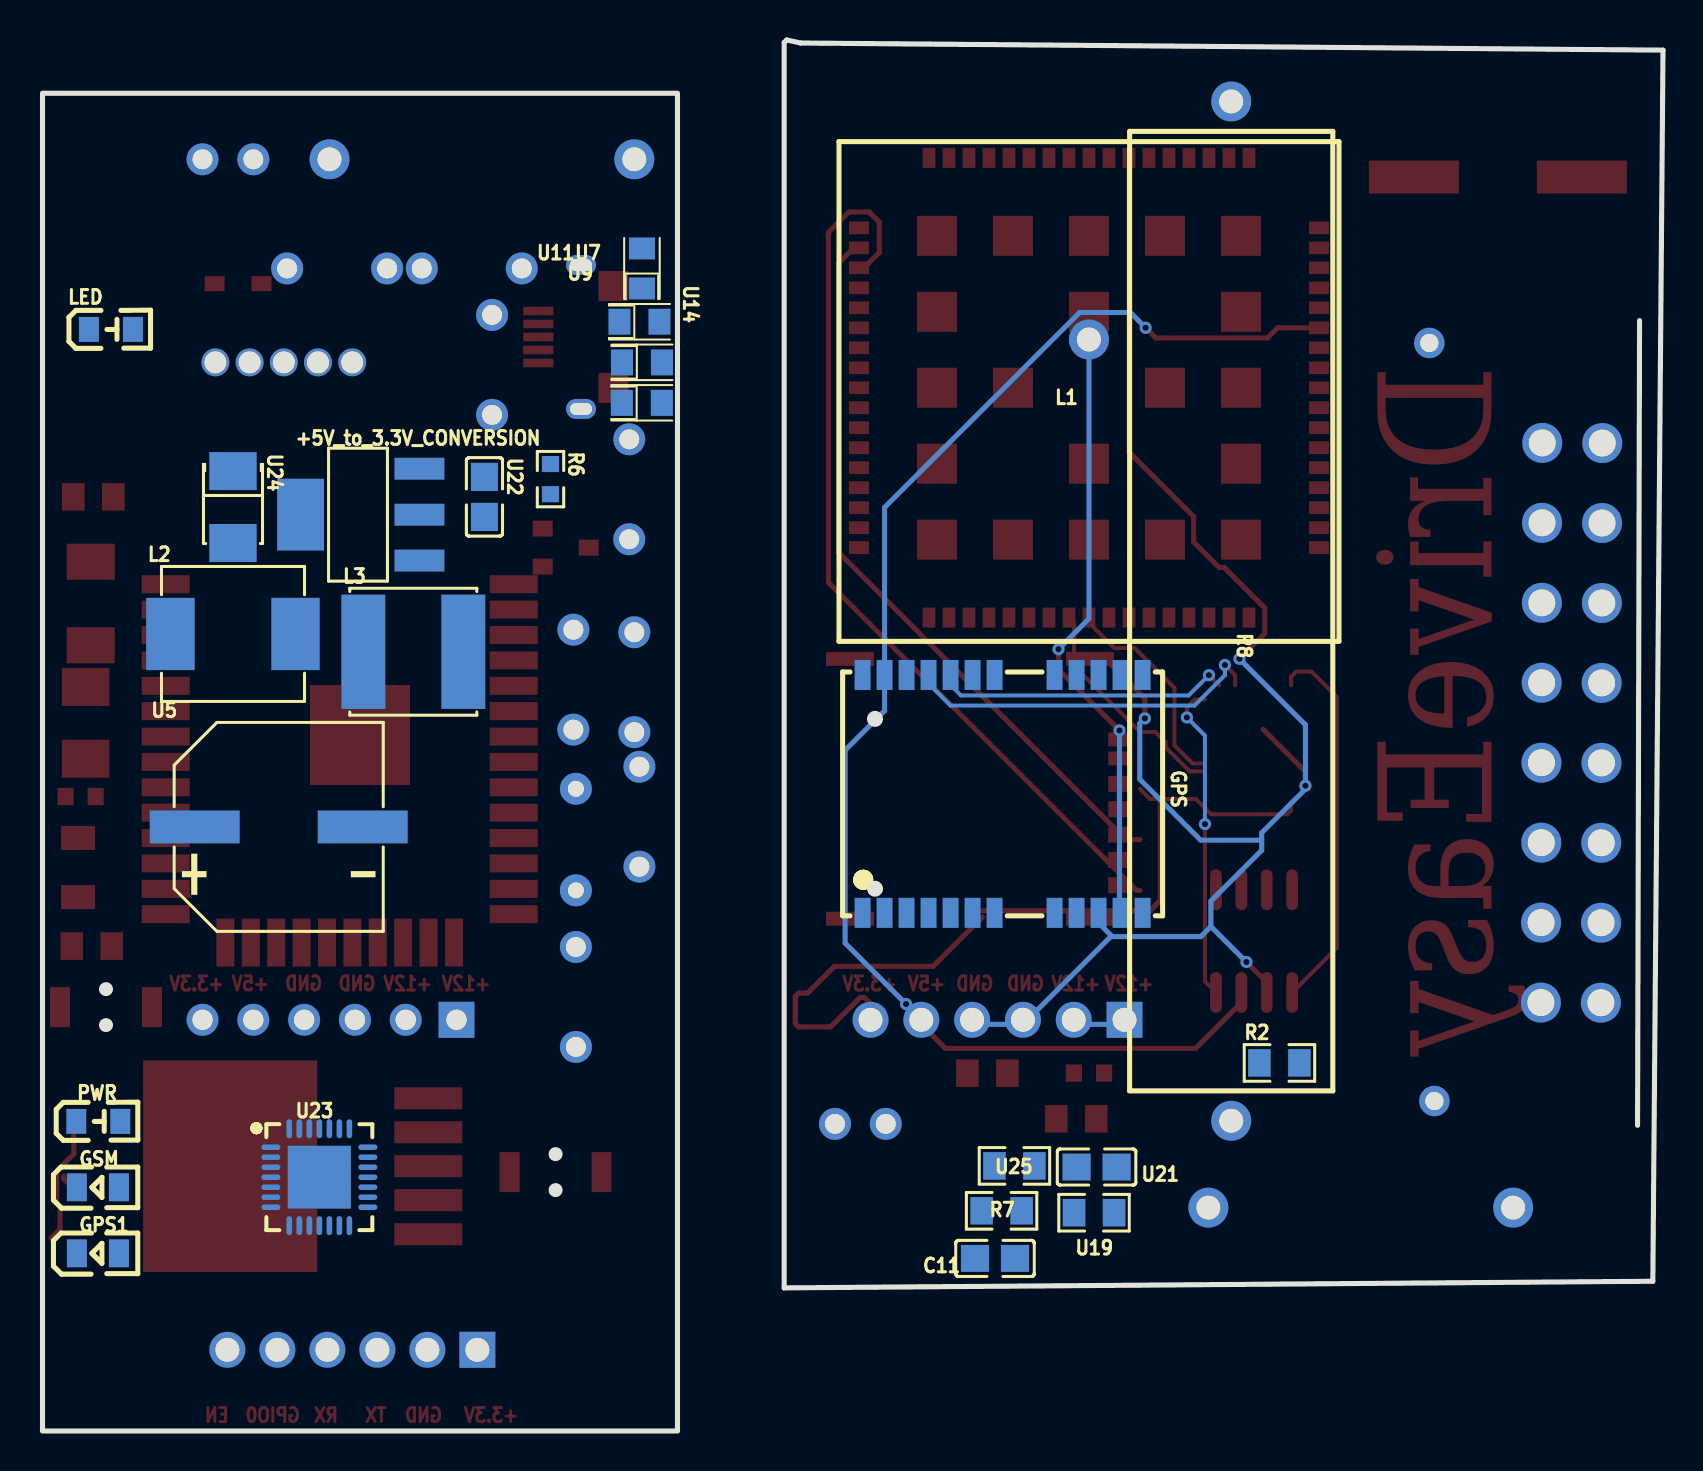
[diagram p6: board, bottom side, seen from below]

Outline 81.03 x 69.6 mm; copper layers: Top Layer, Bottom Layer. Coordinates in mm from the lower left corner of the outline.
Outline path: rectangle 49.28,66.93 81.03,0 ; 0,69.09 0.51,7.49 43.94,7.16 43.94,69.47 43.81,69.6 43.11,69.44 0,69.09
Stack: Top Layer 0.035mm / Dielectric1 1.51mm FR4 er 4.5 / Bottom Layer 0.035mm

## Design rules (mm)
template: JLCPCB Capability(Two Layers Board)
spacing copperThickness1oz (default): track to track 0.102, other pairs 0.152 to 0.3
spacing copperThickness2oz: track to track 0.203, other pairs 0.152 to 0.3
track width copperThickness1oz (default): min 0.127, default 0.254, max 2.54
track width copperThickness2oz: min 0.203, default 0.254, max 2.54
differential pair differentialPair (default): width min 0.127, default 0.254, max 2.54; gap min 0.152, default 0.152
via viaSize (default): diameter min 0.5, default 0.61, max 10; hole min 0.3, default 0.305, max 6.3

## Placement (name value [footprint] x y rotation side)
100nF  100nF  [CAP-TH_L18.0-W6.0-P15.00-D1.2]  59.05 63.63 0 top
1000nf  100nF  [CAP-TH_L7.3-W3.2-P5.00-D0.5]  54.36 29.59 270 top
1000uf  1000uF  [CAP-TH_BD6.3-P2.50-D1.0-FD]  71.75 63.63 0 top
+5V_to_3.3V_CONVERSION  AMS1117-3.3  [SOT-223-3_L6.4-W3.5-P2.30-LS7.0-BR]  65.15 45.85 180 bottom
+12V_to_5V_CONV.  LM2596T-5.0  [TO-220-5L_L10.2-W4.5-P1.71-L]  68.96 53.47 0 top
C5  100nF  [CAP-TH_L18.0-W6.0-P15.00-D1.2]  15.11 11.18 0 top
C9  1000uF  [CAP-TH_BD6.3-P2.50-D1.0-FD]  40.13 15.37 0 top
C11  1nF  [C0805]  33.4 8.64 180 bottom
CAN_TRANS  SN65HVD230D  [SOIC-8_L4.9-W3.9-P1.27-LS6.0-BL]  20.45 24.51 0 top
D1  1N5819WS  [SOD-323_L1.8-W1.3-LS2.5-RD]  71.25 57.4 0 top
GPS  NEO-6M-0-001  [GPSM-SMD_24P-L16.0-W12.2-P1.10]  33.02 31.88 270 bottom
GPS1  KT-0805Y  [LED0805-R-RD]  78.25 8.89 180 bottom
GSM  KT-0805G  [LED0805-R-RD]  78.25 12.19 180 bottom
GSM_MODULE_A7670C  A7670C  [WIRELM-SMD-88_L24.0-W24.0-P1.00-BL]  28.7 52.2 0 top
L1  KH-GPS252504-WY  [ANT-TH_KH-GPS252504-WY]  28.7 54.61 180 bottom
L2  33uH  [IND-SMD_L7.0-W6.6_FXL0630]  71.5 39.88 180 bottom
L3  33uH  [IND-SMD_L6.0-W6.0]  62.48 38.99 180 bottom
LED  NCD0805R1  [LED0805-RD]  77.6 55.12 180 bottom
MICROCONTROLLER  ESP32-WROOM-32  [WIFIM-SMD_39P-L25.5-W18.0-P1.27]  66.17 33.4 0 top
NOREF  -  [Pad_e148]  11.68 54.44 0 top
NOREF#2  -  [Pad_e149]  11.43 16.51 0 top
PLATE1_TO_PLATE2  -  [HDR-TH_6P-P2.54-V-M-1]  33.27 20.57 0 top
PLATE2_TO_PLATE1  -  [HDR-TH_6P-P2.54-V-F]  66.67 20.57 0 top
PWR  NCD0805R1  [LED0805-RD]  78.24 15.49 180 bottom
R1  10kΩ  [R0805]  29.34 15.62 180 top
R2  10kΩ  [R0805]  19.18 18.42 180 bottom
R4  2.7kΩ  [R0603]  28.7 17.91 0 top
R5  1.2kΩ  [R0805]  33.78 17.91 0 top
R6  10kΩ  [R0603]  55.63 47.62 270 bottom
R7  1kΩ  [R0805]  33.07 11.02 180 bottom
R8  2.2Ω  [RES-TH_L48.0-W10.0-P51.00-D0.8]  21.59 41.02 90 bottom
R9  1kΩ  [R0805]  78.49 46.74 180 top
R10  120Ω  [R1206]  79.25 28.19 90 top
R11  1k  [R0603]  79.12 31.75 0 top
R12  1kΩ  [R0805]  78.57 24.26 0 top
SIM_HOLDER  NANO SIM 7P H1.37  [SIM-SMD_NANO-SIM-7P-H1.37]  33.91 32.13 90 top
SW1  KEY_2S3mm*4mm-带定位柱  [KEY-SMD_L4.0-W3.7-LS4.8]  55.37 12.95 0 top
SW2  KEY_2S3mm*4mm-带定位柱  [KEY-SMD_L4.0-W3.7-LS4.8]  77.85 21.21 0 top
TVS_DIODE1  PESD1CAN  [SOT-23_L2.9-W1.3-P1.90-LS2.4-BR]  54.86 44.2 0 top
U2  100nF  [CAP-TH_L5.0-W2.5-P5.00-D1.0]  54.48 37.59 90 top
U5  470uF  [CAP-SMD_BD10.0-L10.3-W10.3-LS11.0-FD-1]  69.21 30.23 180 bottom
U7  10uf  [CAP-SMD_L2.0-W1.3-FD]  51.18 55.5 180 bottom
U8  100nF  [CAP-TH_L5.0-W2.5-P5.00-D1.0]  51.18 30.73 90 top
U9  10uf  [CAP-SMD_L2.0-W1.3-FD]  51.05 53.47 180 bottom
U10  100nF  [CAP-TH_L5.0-W2.5-P5.00-D1.0]  51.43 37.47 270 top
U11  10uf  [CAP-SMD_L2.0-W1.3-FD]  51.06 51.44 180 bottom
U12  100nF  [CAP-TH_L5.0-W2.5-P5.00-D1.0]  51.69 47.12 90 top
U13  100nF  [CAP-TH_L5.0-W2.5-P5.00-D1.0]  58.55 53.34 90 top
U14  10uf  [CAP-SMD_L2.0-W1.3-FD]  51.05 58.17 90 bottom
U15  100nF  [CAP-TH_L5.0-W2.5-P5.00-D1.0]  59.56 58.17 0 top
U16  100nF  [CAP-TH_L5.0-W2.5-P5.00-D1.0]  66.29 58.17 0 top
U17  -  [TO-263-5_L10.2-W8.6-P1.70-LS14.4-TL]  66.69 13.25 0 top
U18  100nF  [CAP-TH_L5.0-W2.5-P5.00-D1.0]  54.36 21.72 90 top
U19  10K  [R0805]  28.45 10.92 180 bottom
U21  0.1uF/100V  [C0805]  28.32 13.21 180 bottom
U22  0.1uF/100V  [C0805]  58.93 46.74 270 bottom
U23  CP2102  [QFN-28_L5.0-W5.0-P0.50-TL-EP3.2]  67.18 12.7 180 bottom
U24  1uF  [CAP-SMD_L3.5-W2.8-FD]  71.5 46.23 270 bottom
U25  10K  [R0805]  32.43 13.27 180 bottom
U26  HEADER_MALE-XH_1X6P_2.54MM  [CONN-TH_6P-P2.50-V-M_HEADER-MALE]  65.53 4.06 0 top
U28  SMBJ6.5CA  [SMB_L4.6-W3.5-LS5.3-BI]  78.61 41.4 90 top
U29  贴片钽电容100uF+-20%6.3VB型  [CAP-SMD_L3.5-W2.8-FD]  78.87 35.43 90 top
U30  OBD2-male-16pin  [CONN-TH_OBD2]  4.57 35.43 270.1 top
U31  470uF  [CAP-SMD_BD10.0-L10.3-W10.3-LS11.0-FD-1]  8.25 62.74 0 top
USB_TO_UART  MICRO5P  [MICRO-USB-SMD_MICRO-21-P2-T3]  54.36 54.74 90 top

## Footprints (pads in the part's own frame, mm; a bottom-side part is the same pattern mirrored in y, then rotated)
ANT-TH_KH-GPS252504-WY
  round 2 hole 1.2: 1(0,0)
C0805
  rect 1.41x1.35 smd: 1(-1,0) 2(1,0)
CAP-SMD_BD10.0-L10.3-W10.3-LS11.0-FD-1
  rect 4.5x1.65 smd: 1(-4.2,0) 2(4.2,0)
CAP-SMD_L2.0-W1.3-FD
  rect 1.1x1.3 smd: 1(-1,0) 2(1,0)
CAP-SMD_L3.5-W2.8-FD
  rect 1.9x2.376 smd: 1(-1.798,0) 2(1.798,0)
CAP-TH_BD6.3-P2.50-D1.0-FD
  round 1.6 hole 1: 1(-1.27,0) 2(1.27,0)
CAP-TH_L5.0-W2.5-P5.00-D1.0
  round 1.6 hole 1: 1(-2.5,0) 2(2.5,0)
CAP-TH_L7.3-W3.2-P5.00-D0.5
  round 1.6 hole 0.8: 1(-2.54,0) 2(2.54,0)
CAP-TH_L18.0-W6.0-P15.00-D1.2
  round 1.999 hole 1.199: 1(-7.62,0) 2(7.62,0)
CONN-TH_6P-P2.50-V-M_HEADER-MALE
  rect 1.8x1.8 hole 1.2: 1(-6.25,0)
  round 1.8 hole 1.2: 2(-3.75,0) 3(-1.25,0) 4(1.25,0) 5(3.75,0) 6(6.25,0)
CONN-TH_OBD2
  round 2 hole 1.35: 1(-14,-1.5) 2(-10,-1.5) 3(-6,-1.5) 4(-2,-1.5) 5(2,-1.5) 6(6,-1.5) 7(10,-1.5) 8(14,-1.5) 9(-14,1.5) 10(-10,1.5) 11(-6,1.5) 12(-2,1.5) 13(2,1.5) 14(6,1.5) 15(10,1.5) 16(14,1.5)
GPSM-SMD_24P-L16.0-W12.2-P1.10
  rect 1.5x0.8 smd: 1(5.95,-7) 2(5.95,-5.9) 3(5.95,-4.8) 4(5.95,-3.7) 5(5.95,-2.6) 6(5.95,-1.5) 7(5.95,-0.4) 8(5.95,2.6) 9(5.95,3.7) 10(5.95,4.8) 11(5.95,5.9) 12(5.95,7) 13(-5.95,7) 14(-5.95,5.9) 15(-5.95,4.8) 16(-5.95,3.7) 17(-5.95,2.6) 18(-5.95,-0.4) 19(-5.95,-1.5) 20(-5.95,-2.6) 21(-5.95,-3.7) 22(-5.95,-4.8) 23(-5.95,-5.9) 24(-5.95,-7)
HDR-TH_6P-P2.54-V-F
  rect 1.8x1.8 hole 1.02: 1(-6.35,0)
  round 1.6 hole 1.02: 2(-3.81,0) 3(-1.27,0) 4(1.27,0) 5(3.81,0) 6(6.35,0)
HDR-TH_6P-P2.54-V-M-1
  rect 1.8x1.8 hole 1.2: 1(-6.35,0)
  round 1.8 hole 1.2: 2(-3.81,0) 3(-1.27,0) 4(1.27,0) 5(3.81,0) 6(6.35,0)
IND-SMD_L6.0-W6.0
  rect 2.2x5.72 smd: 1(-2.499,0) 2(2.499,0)
IND-SMD_L7.0-W6.6_FXL0630
  rect 2.424x3.62 smd: 1(3.128,0) 2(-3.128,0)
KEY-SMD_L4.0-W3.7-LS4.8
  rect 1x2 smd: 1(-2.3,0) 2(2.3,0)
LED0805-R-RD
  rect 1x1.399 smd: 1(1.05,0) 2(-1.05,0)
LED0805-RD
  rect 1x1.25 smd: 1(-1.1,0) 2(1.1,0)
MICRO-USB-SMD_MICRO-21-P2-T3
  rect 0.43x1.51 smd: 1(-1.3,-1.877) 2(-0.65,-1.877) 3(0,-1.877) 4(0.65,-1.877) 5(1.3,-1.877)
  oval 1x1.5 hole 0.61x1.1: 6(-3.6,0.258) 6(3.6,0.258)
  rect 1.5x1.5 smd: 6(-2.55,1.873) 6(2.55,1.877)
Pad_e148
  round 1.524 hole 0.914: 1(0,0)
Pad_e149
  round 1.524 hole 0.914: 2(0,0)
QFN-28_L5.0-W5.0-P0.50-TL-EP3.2
  oval 0.95x0.28 smd: 1(-2.425,1.502) 2(-2.425,1.001) 3(-2.425,0.5) 4(-2.425,0) 5(-2.425,-0.5) 6(-2.425,-1) 7(-2.425,-1.501) 15(2.425,-1.501) 16(2.425,-1) 17(2.425,-0.5) 18(2.425,0) 19(2.425,0.5) 20(2.425,1.001) 21(2.425,1.502)
  oval 0.28x0.95 smd: 8(-1.502,-2.425) 9(-1.001,-2.425) 10(-0.5,-2.425) 11(0,-2.425) 12(0.5,-2.425) 13(1,-2.425) 14(1.501,-2.425) 22(1.501,2.425) 23(1,2.425) 24(0.5,2.425) 25(0,2.425) 26(-0.5,2.425) 27(-1.001,2.425) 28(-1.502,2.425)
  rect 3.15x3.15 smd: 29(0,0)
R0603
  rect 0.806x0.864 smd: 1(-0.753,0) 2(0.753,0)
R0805
  rect 1.133x1.377 smd: 1(-1,0) 2(1,0)
R1206
  rect 1.208x1.701 smd: 1(-1.479,0) 2(1.479,0)
RES-TH_L48.0-W10.0-P51.00-D0.8
  round 2 hole 1.2: 1(-25.5,0) 2(25.5,0)
SIM-SMD_NANO-SIM-7P-H1.37
  rect 0.7x2.4 smd: 8(6.5,5.26) 9(-6.5,5.26) 10(-6.5,-6.74) 11(6.5,-6.74)
  rect 0.8x1.138 smd: C1(0.25,6.74) C2(-2.29,6.74) C3(-4.83,6.74) C6(-1.02,6.74) C7(-3.56,6.74)
  rect 0.7x1.138 smd: C5(1.52,6.74) CD(2.47,6.74)
SMB_L4.6-W3.5-LS5.3-BI
  rect 1.8x2.4 smd: 1(-2.091,0) 2(2.091,0)
SOD-323_L1.8-W1.3-LS2.5-RD
  rect 1x0.75 smd: 1(-1.173,0) 2(1.173,0)
SOIC-8_L4.9-W3.9-P1.27-LS6.0-BL
  oval 0.588x2.045 smd: 1(-1.905,-2.57) 2(-0.635,-2.57) 3(0.635,-2.57) 4(1.905,-2.57) 5(1.905,2.57) 6(0.635,2.57) 7(-0.635,2.57) 8(-1.905,2.57)
SOT-23_L2.9-W1.3-P1.90-LS2.4-BR
  rect 1x0.8 smd: 1(1.15,-0.95) 2(1.15,0.95) 3(-1.15,0)
SOT-223-3_L6.4-W3.5-P2.30-LS7.0-BR
  rect 2.5x1.1 smd: 1(2.97,-2.3) 2(2.97,0) 3(2.97,2.3)
  rect 2.34x3.6 smd: 4(-2.97,0)
TO-220-5L_L10.2-W4.5-P1.71-L
  round 1.4 hole 1.1: 1(-3.42,0) 2(-1.71,0) 3(0,0) 4(1.71,0) 5(3.42,0)
TO-263-5_L10.2-W8.6-P1.70-LS14.4-TL
  rect 3.401x1.1 smd: 1(-4.953,3.401) 2(-4.953,1.7) 3(-4.953,0) 4(-4.953,-1.7) 5(-4.953,-3.401)
  rect 8.704x10.586 smd: 6(4.953,0)
WIFIM-SMD_39P-L25.5-W18.0-P1.27
  rect 2.4x0.9 smd: 1(-8.7,8.965) 2(-8.7,7.695) 3(-8.7,6.425) 4(-8.7,5.155) 5(-8.7,3.885) 6(-8.7,2.615) 7(-8.7,1.345) 8(-8.7,0.075) 9(-8.7,-1.195) 10(-8.7,-2.465) 11(-8.7,-3.735) 12(-8.7,-5.005) 13(-8.7,-6.275) 14(-8.7,-7.545) 25(8.7,-7.545) 26(8.7,-6.275) 27(8.7,-5.005) 28(8.7,-3.735) 29(8.7,-2.465) 30(8.7,-1.195) 31(8.7,0.075) 32(8.7,1.345) 33(8.7,2.615) 34(8.7,3.885) 35(8.7,5.155) 36(8.7,6.425) 37(8.7,7.695) 38(8.7,8.965)
  rect 0.9x2.4 smd: 15(-5.715,-8.965) 16(-4.445,-8.965) 17(-3.175,-8.965) 18(-1.905,-8.965) 19(-0.635,-8.965) 20(0.635,-8.965) 21(1.905,-8.965) 22(3.175,-8.965) 23(4.445,-8.965) 24(5.715,-8.965)
  rect 5x5 smd: 39(-1.017,1.422)
WIRELM-SMD-88_L24.0-W24.0-P1.00-BL
  rect 0.64x1 smd: 1(-8,-11.5) 2(-7,-11.5) 3(-6,-11.5) 4(-5,-11.5) 5(-4,-11.5) 6(-3,-11.5) 7(-2,-11.5) 8(-1,-11.5) 9(0,-11.5) 10(1,-11.5) 11(2,-11.5) 12(3,-11.5) 13(4,-11.5) 14(5,-11.5) 15(6,-11.5) 16(7,-11.5) 17(8,-11.5) 35(8,11.5) 36(7,11.5) 37(6,11.5) 38(5,11.5) 39(4,11.5) 40(3,11.5) 41(2,11.5) 42(1,11.5) 43(0,11.5) 44(-1,11.5) 45(-2,11.5) 46(-3,11.5) 47(-4,11.5) 48(-5,11.5) 49(-6,11.5) 50(-7,11.5) 51(-8,11.5)
  rect 1x0.64 smd: 18(11.5,-8) 19(11.5,-7) 20(11.5,-6) 21(11.5,-5) 22(11.5,-4) 23(11.5,-2.999) 24(11.5,-2) 25(11.5,-1) 26(11.5,0.001) 27(11.5,1) 28(11.5,2.001) 29(11.5,3) 30(11.5,4) 31(11.5,5) 32(11.5,6) 33(11.5,7) 34(11.5,8) 52(-11.5,8) 53(-11.5,7) 54(-11.5,6) 55(-11.5,5) 56(-11.5,4) 57(-11.5,3) 58(-11.5,2) 59(-11.5,1) 60(-11.5,0) 61(-11.5,-1) 62(-11.5,-2) 63(-11.5,-3) 64(-11.5,-4) 65(-11.5,-5) 66(-11.5,-6) 67(-11.5,-7) 68(-11.5,-8)
  custom 2x2 smd: 69(-7.6,-7.6) 70(-3.8,-7.6) 71(0,-7.6) 72(3.8,-7.6) 73(7.6,-7.6) 74(7.6,-3.8) 75(0,-3.8) 76(-7.6,-3.8) 77(-7.6,0) 78(-3.8,0) 79(3.8,0) 80(7.6,0) 81(7.6,3.8) 82(0,3.8) 83(-7.6,3.8) 84(7.6,7.6) 85(3.8,7.6) 86(0,7.6) 87(-3.8,7.6) 88(-7.6,7.6)

## Nets
As in the schematic.

Pads without a net: CAN_TRANS 5; GPS 1 2 4 5 6 7 8 9 14 15 16 17 18 19; GSM_MODULE_A7670C 2 3 4 5 6 7 8 11 12 13 14 15 19 20 21 22 23 24 25 26 27 28 29 35 36 37 38 39 40 41 42 43 44 46 47 48 49 50 51 53 54 58 59 60 61 62 63 64 65 66 67 68 69 70 71 72 73 74 75 76 77 78 79 80 81 82 83 84 85 86 87 88; MICROCONTROLLER 4 5 6 7 8 9 10 13 14 16 17 18 19 20 21 22 23 30 31 32 33 36 37; NOREF 1; NOREF#2 2; SIM_HOLDER C5 C6; U23 1 2 10 11 12 13 14 15 16 17 18 19 20 21 22 23 27; U30 1 2 3 7 8 9 10 11 12 13 15; USB_TO_UART 4

## Via types
v1: diameter 0.61, hole 0.305, Top Layer to Bottom Layer, 12 vias

## Routing (per net, layer and track width the routed paths; a pad name or vN(x,y) marks a point on that pad's centre or on a via; arc(x,y) is an arc through that point)
+3.3V: length 114.4
  Top Layer w0.2: 26.15,32.13 25.64,31.62 23.36,31.62 22.6,30.86 18.79,30.86 18.6,31.05 18.6,31.5
  Top Layer w0.254: v1(25.87,55.2) 25.36,54.69 19.77,54.69 19.26,55.2 17.2,55.2 ; 39.1,20.87 39.93,21.69 40.14,21.69 41.61,20.22 43.22,20.22 43.39,20.38 43.39,21.75 43.22,21.91 42.77,21.91 41.43,23.25 36.49,23.25 34.03,25.72 ; 39.1,20.87 38.99,20.75 38.99,20.69 ; 39.1,20.87 39.62,20.35 ; 39.1,20.87 38.99,20.98 38.99,21.07 ; CAN_TRANS.3 21.08,21.43 23.37,19.15 35.89,19.15 37.08,20.35 37.08,20.6 v1(37.85,21.36) ; 25.14,31.62 25.14,26.54 25.64,26.03 34.03,26.03
  Bottom Layer w0.254: v1(37.85,21.36) 40.89,24.41 40.89,34.06 38.92,36.04 38.92,46.21 29.17,55.96 26.63,55.96 v1(25.87,55.2)
+12V_IN: length 2.5
  Bottom Layer w0.254: 29.46,20.35 26.92,20.35
GND: length 89.4
  Top Layer w0.254: GSM_MODULE_A7670C.45 26.7,48.98 23.47,45.75 23.47,44.48 22.2,43.21 21.94,43.21 19.91,41.17 19.91,39.91 v1(21.18,38.64) ; 79.46,15.49 79.46,13.86 80.32,13.01 80.32,11.38 80.15,11.21 80.15,10.1 80.6,9.65 ; v1(17.88,32.28) 17.88,32.99 20,35.11 ; v1(20.83,23.47) 19.81,22.45 19.81,21.94 ; 27.63,38.38 25.91,36.65 v1(25.91,35.66)
  Bottom Layer w0.254: 27.54,24.73 23.11,24.73 22.61,25.24 ; 27.54,24.73 28.22,25.42 GPS.10 ; 27.54,24.73 27.61,24.73 32,20.35 34.54,20.35 ; 22.61,25.24 v1(20.83,23.47) ; 22.61,25.24 22.61,26.51 20.07,29.05 20.07,29.56 ; 20.07,29.56 20.07,29.93 17.79,32.2 17.79,32.24 17.84,32.28 v1(17.88,32.28) 17.88,35.33 v1(21.18,38.64) ; 20.07,29.56 23.11,29.56 26.16,32.61 26.16,35.4 v1(25.91,35.66)
CAN_RX: length 15.9
  Top Layer w0.2: 22.9,36.6 23.41,36.6 23.8,36.21 v1(23.8,35.7) ; CAN_TRANS.4 22.9,22.49 v1(22.9,30.37)
  Bottom Layer w0.2: v1(23.8,35.7) 22.9,34.8 v1(22.9,30.37)
CAN_TX: length 19.1
  Top Layer w0.2: 18.6,37.31 18.6,37.74 18.34,38 17.58,38 16.31,36.73 16.31,24.17 CAN_TRANS.1
GPS_RX: length 18.1
  Top Layer w0.2: 21.4,37.31 21.4,37.82 v1(21.9,38.33)
  Bottom Layer w0.2: GPS.21 36.64,37.74 36.64,37.31 35.62,36.29 23.43,36.29 21.9,37.82 v1(21.9,38.33)
GPS_TX: length 14.8
  Top Layer w0.2: 22.2,37.31 v1(22.7,37.82)
  Bottom Layer w0.2: v1(22.7,37.82) 23.72,36.8 35.1,36.8 35.62,37.32 GPS.20
GSM_RX: length 10.7
  Top Layer w0.2: GSM_MODULE_A7670C.9 28.7,40.44 27.43,39.17 26.42,39.17 24.43,37.18 24.43,34.3 23.53,33.4 22.9,33.4
GSM_TX: length 11.4
  Top Layer w0.2: 22.9,33 23.67,33 24.88,34.21 24.88,34.47 25.38,34.97 26.15,34.97 29.45,38.28 29.45,40.44 GSM_MODULE_A7670C.10
SIM_CLK: length 45.5
  Top Layer w0.254: GSM_MODULE_A7670C.32 39.95,58.2 39.19,58.96 39.19,60.48 39.69,60.99 40.71,60.99 41.73,59.97 41.73,42.45 26.32,27.05 26.15,27.05
SIM_RST: length 36.8
  Top Layer w0.254: GSM_MODULE_A7670C.33 40.46,59.2 41.22,58.44 41.22,43.96 26.85,29.59 26.15,29.59
$1N1116: length 30.6
  Top Layer w0.254: v1(30.23,39.12) 30.23,38.1 v1(27.18,35.05)
  Bottom Layer w0.254: v1(30.23,39.12) 28.7,40.64 L1.1 ; GPS.11 27.18,25.98 v1(27.18,35.05)
$1N5278: length 0.7
  Top Layer w0.254: 79.54,12.19 79.96,12.62 79.96,12.76

## Text on the board
Top Layer: +12V | GND | +5V | +3.3V | TX | RX | GPIO0 | EN | DriveEasy
